# EAGLE design node_motor (EAGLE 6.6.0)
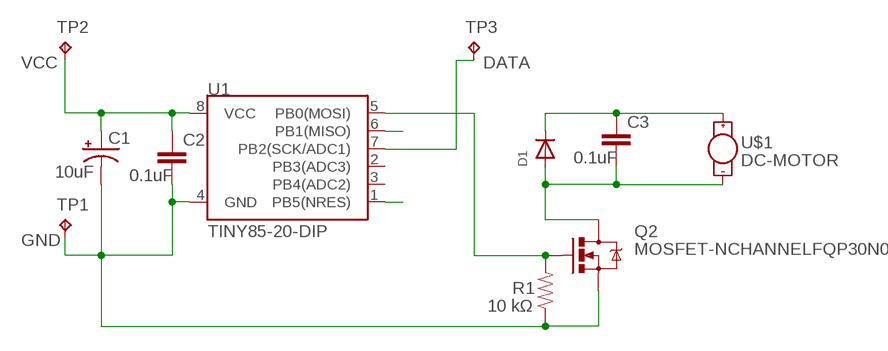
[diagram p0: schematic, sheet 1]

## Parts
C1  10uF  10UF-16V-10%(TANT)  [EIA3216]
C2  0.1uF  CAP1206  [1206]
C3  0.1uF  CAP1206  [1206]
D1  DIODESMA  [SMADIODE]
Q2  MOSFET-NCHANNELFQP30N06L  [TO220V]
R1  10 kΩ  RESISTOR1206  [1206]
TP1  PADSTP13R  [CIRCLE-PAD-1/4]
TP2  PADSTP13R  [CIRCLE-PAD-1/4]
TP3  PADSTP13R  [CIRCLE-PAD-1/4]
U1  TINY85-20-DIP  ATTINY45TINY45-20-DIP  [DIP08]
U$1  DC-MOTOR  [DC-MOTOR-20MM]

## Nets
GND: C1.C(-) C2.2 Q2.3(S) R1.1 TP1.TP U1.4(GND)
MISO-6: U1.6(PB1(MISO))
N$1: Q2.1(G) R1.2 U1.5(PB0(MOSI))
N$3: C3.2 D1.A Q2.2(D) U$1.-
N$7: C3.1 D1.C U$1.+
RST: U1.1(PB5(NRES))
SCK-7: TP3.TP U1.7(PB2(SCK/ADC1))
VCC: C1.A(+) C2.1 TP2.TP U1.8(VCC)
Unconnected: U1.2(PB3(ADC3)) U1.3(PB4(ADC2))

## Library data of the parts
C1 = SparkFun-Capacitors:10UF-16V-10%(TANT): CAP-00811 1206/EIA-3216 Tantalum capacitor; PROD_ID: CAP-00811
C2 C3 = SparkFun-Capacitors:CAP: Capacitor Standard 0603 ceramic capacitor, and 0.1" leaded capacitor.
D1 = adafruit:DIODE: Diode SMADIODE - SMA Surface Mount Package 20V 1A Schottky Diode Digikey: 641-1014-6-ND DO-1N4148 - Through Hole Small Current Diode SOD-123 20V 1 A (.5mV Vf) Schottky Diode - Digikey: MBRX120TPMSCT-ND SOD-323 10V 570mA (.38mV Vf, 3ns) Schottky Diode - Digikey: ZLLS410CT-ND SOD-523 30V 30mA Schottky Diode (RB751S-40TE61) - Digikey: RB751S-40TE61CT-ND SOT23-R/W - SOT23 Package (R = Solder Paste/Reflow Ovens, W = Hand-Soldering) BAT54Film 40V 300mA - Digikey: 497-7162-1-ND
Q2 = SparkFun-DiscreteSemi:MOSFET-NCHANNEL: Common NMOSFET Parts MFG P/N Store ID Prod ID FDD8780 TRANS-09984 SI7820DN TRANS-11055 FDS6630A IC-08089 2N7002PW TRANS-11151 FQP30N06L COM-10213 TRANS-10060 BSS123LT1G TRANS-08345 BSS138 TRANS-00830 BS170 2N7000; PROD_ID: TRANS-10060
R1 = SparkFun-Passives:RESISTOR: Resistor Basic schematic elements and footprints for 0603, 1206, and PTH resistors.
TP1 = swamy-library:PADS: Pads; TP_SIGNAL_NAME: GND
TP2 = swamy-library:PADS: Pads; TP_SIGNAL_NAME: VCC
TP3 = swamy-library:PADS: Pads; TP_SIGNAL_NAME: DATA
U1 = SparkFun-DigitalIC:ATTINY45: Atmel 8-pin 2/4/8kB flash uC; PROD_ID: IC-09439; VALUE: TINY45-20-DIP
U$1 = swamy-library:DC-MOTOR: DC Motor- 20mm

## Board
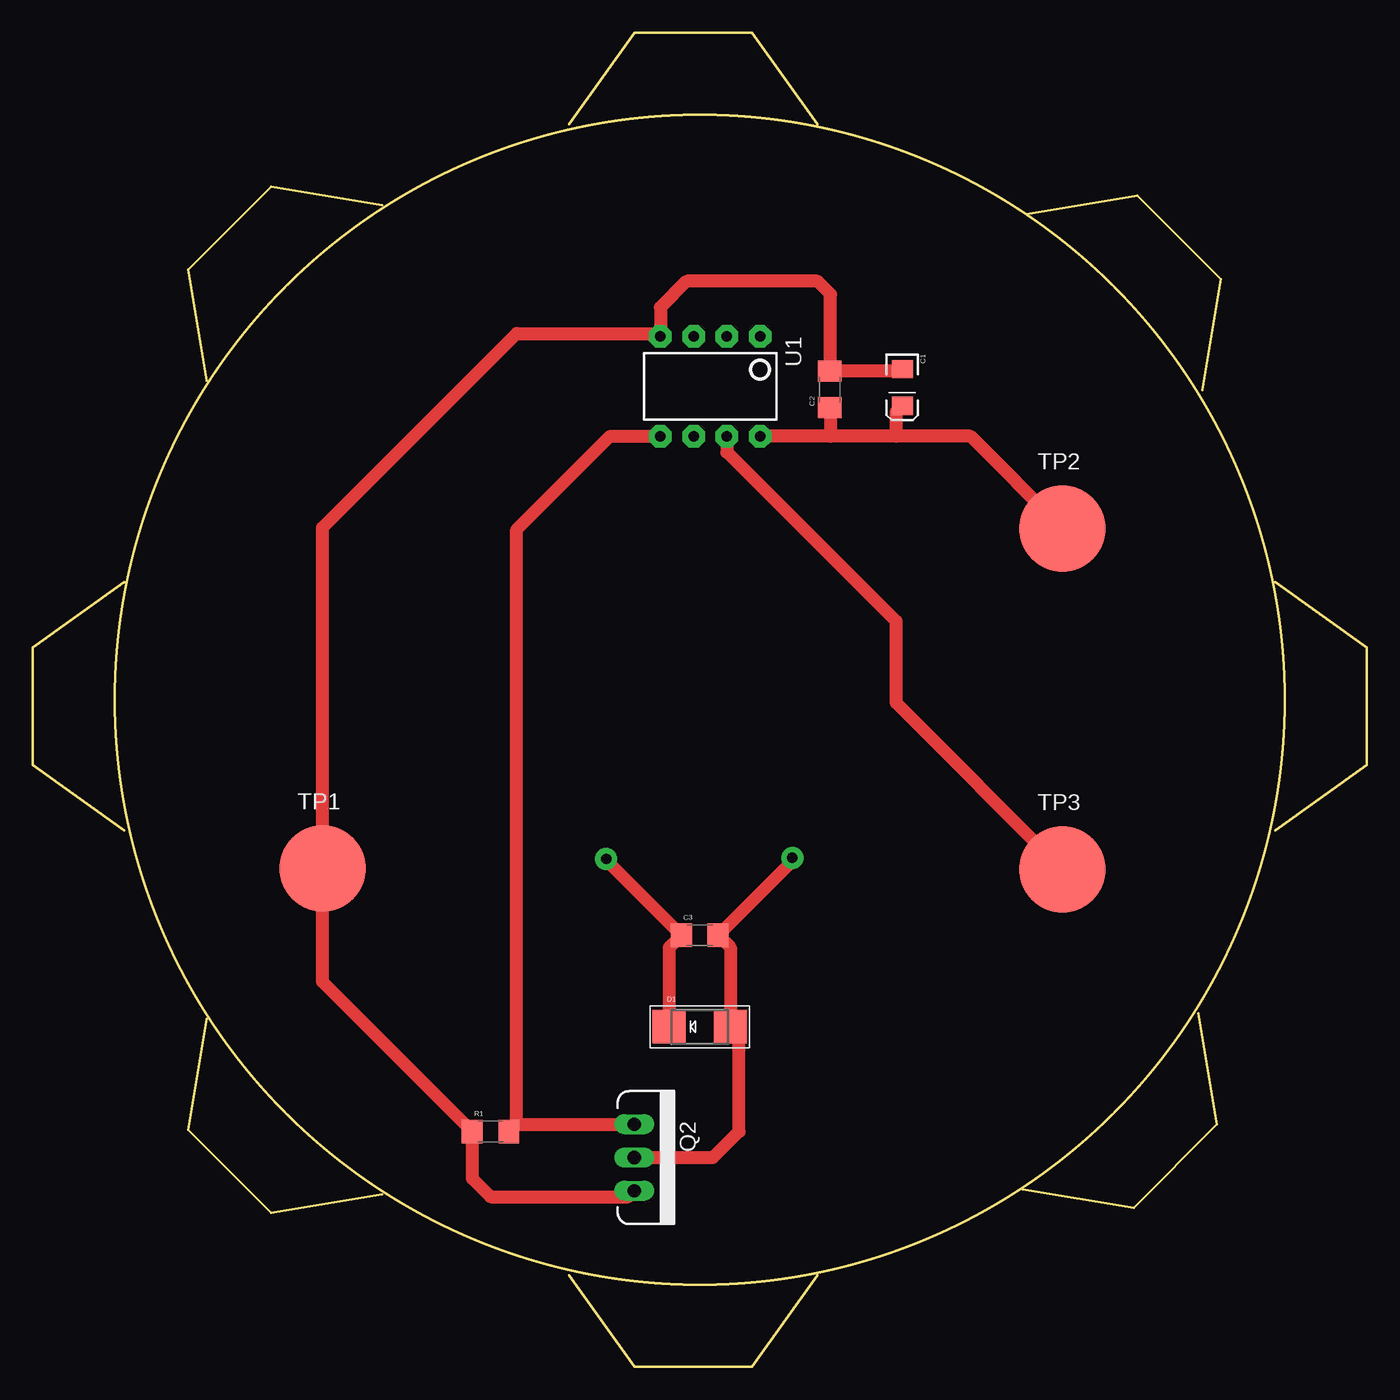
[diagram p1: board, top side]
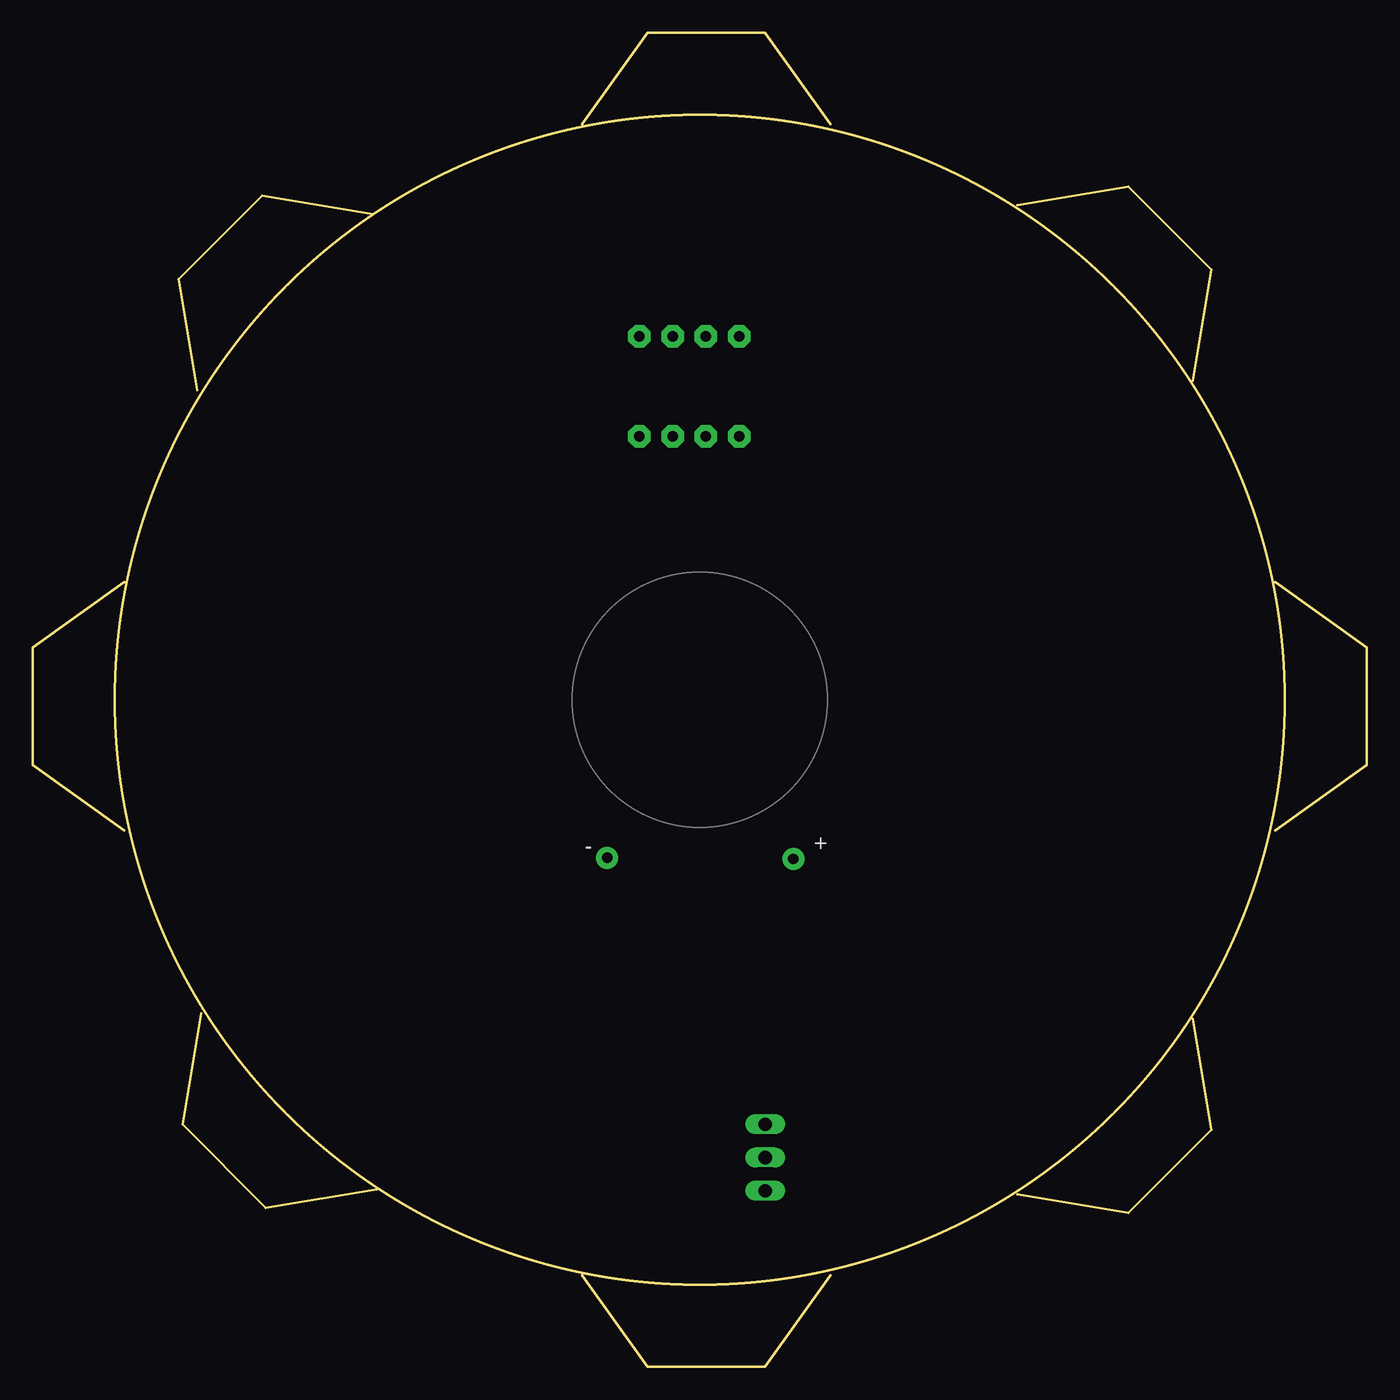
[diagram p2: board, bottom side, seen from below]

Size 102 x 102 mm. Coordinates in mm from the lower left corner, seen from the top.
Outline: 60,7 55,0 46,0 41,7
Outline: 95,60 102,55 102,46 95,41
Outline: 41,95 46,102 55,102 60,95
Outline: 75.98,88.12 84.46,89.54 90.83,83.17 89.41,74.69
Outline: 89.12,27.02 90.54,18.54 84.17,12.17 75.69,13.59
Outline: 13.29,75.39 11.88,83.88 18.24,90.24 26.73,88.83
Outline: 7,41 0,46 0,55 7,60
Outline: 26.73,13.17 18.24,11.76 11.88,18.12 13.29,26.61
Outline: circle at 51,51 radius 44.69
Copper layers (1*16): Top 0.035mm / dielectric 1.5mm / Bottom 0.035mm
Design rules "default": minimum track width 10mil, minimum drill 24mil, track to track 8mil, track to pad 8mil, pad to pad 8mil, via to via 8mil, smd to smd 8mil, copper to edge 40mil, drill to drill 8mil, minimum pad ring 10mil, minimum via ring 8mil, stop-mask expansion 4mil, vias tented up to drill 0mil, thermal gap 10mil

### Footprints (pad centres in the part's own frame; a part is rotated, then mirrored left to right if it is on the bottom)
EIA3216 = smd 1.4 x 1.6: A 1.4,0; C -1.4,0
1206 = smd 1.6 x 1.8: 1 -1.4,0; 2 1.4,0
SMADIODE = smd 2.54 x 2.54: A 2.349,0; C -2.349,0
TO220V = drill 1.016 long: 1 -2.54,0; 2 0,0; 3 2.54,0
CIRCLE-PAD-1/4 = smd 6.604 x 6.604: TP 0,0
DIP08 = drill 0.813 pad 1.727 octagon: 1 -3.81,-3.81; 2 -1.27,-3.81; 3 1.27,-3.81; 4 3.81,-3.81; 5 3.81,3.81; 6 1.27,3.81; 7 -1.27,3.81; 8 -3.81,3.81
DC-MOTOR-20MM = drill 0.8 pad 1.676: + 7.16,-12.17; - -7.08,-12.08

### Placement (x,y rotation side)
C1  66.48,74.88 270 top
C2  60.94,74.72 90 top
C3  51,33 0 top
D1  51,26 0 top
Q2  46,16 270 top
R1  35,18 0 top
TP1  22.16,38.1 0 top
TP2  78.74,64.1 0 top
TP3  78.74,38.04 0 top
U1  51.8,74.96 180 top
U$1  51,51 0 bottom

### Tracks (layer width: path | path; a pad name or v marks a point on that pad's centre or on a via)
GND
  Top 1: C1.C 66.32,76.12 C2.2 61,76.18 61,82 60,83 50,83 47.99,80.99 U1.4 47.76,79 37,79 22.16,64.16 TP1.TP 22.16,29.44 R1.1 33.6,14.4 35,13 45.54,13 Q2.3
N$1
  Top 1: U1.5 44.15,71.15 37,64 37,18.6 R1.2 36.94,18.54 Q2.1
N$3
  Top 1: Q2.2 52,16 54,18 54,25.35 D1.A 53.35,32.05 C3.2 58.08,38.68 U$1.-
N$7
  Top 1: U$1.+ 43.84,38.76 C3.1 48.65,32.05 D1.C
SCK-7
  Top 1: U1.7 53.07,69.93 66,57 66,50.78 TP3.TP
VCC
  Top 1: TP2.TP 71.69,71.15 66,71.15 | 66,71.15 61,71.15 | 61,71.15 U1.8 | C2.1 61,73.26 61,71.15 | C1.A 66,73 66,71.15

### Text on the board
tLabels: Motor Module | VCC | GND | DATA